# EAGLE schematic Sparkfun_MPU-9150_breakout (EAGLE 6.3)
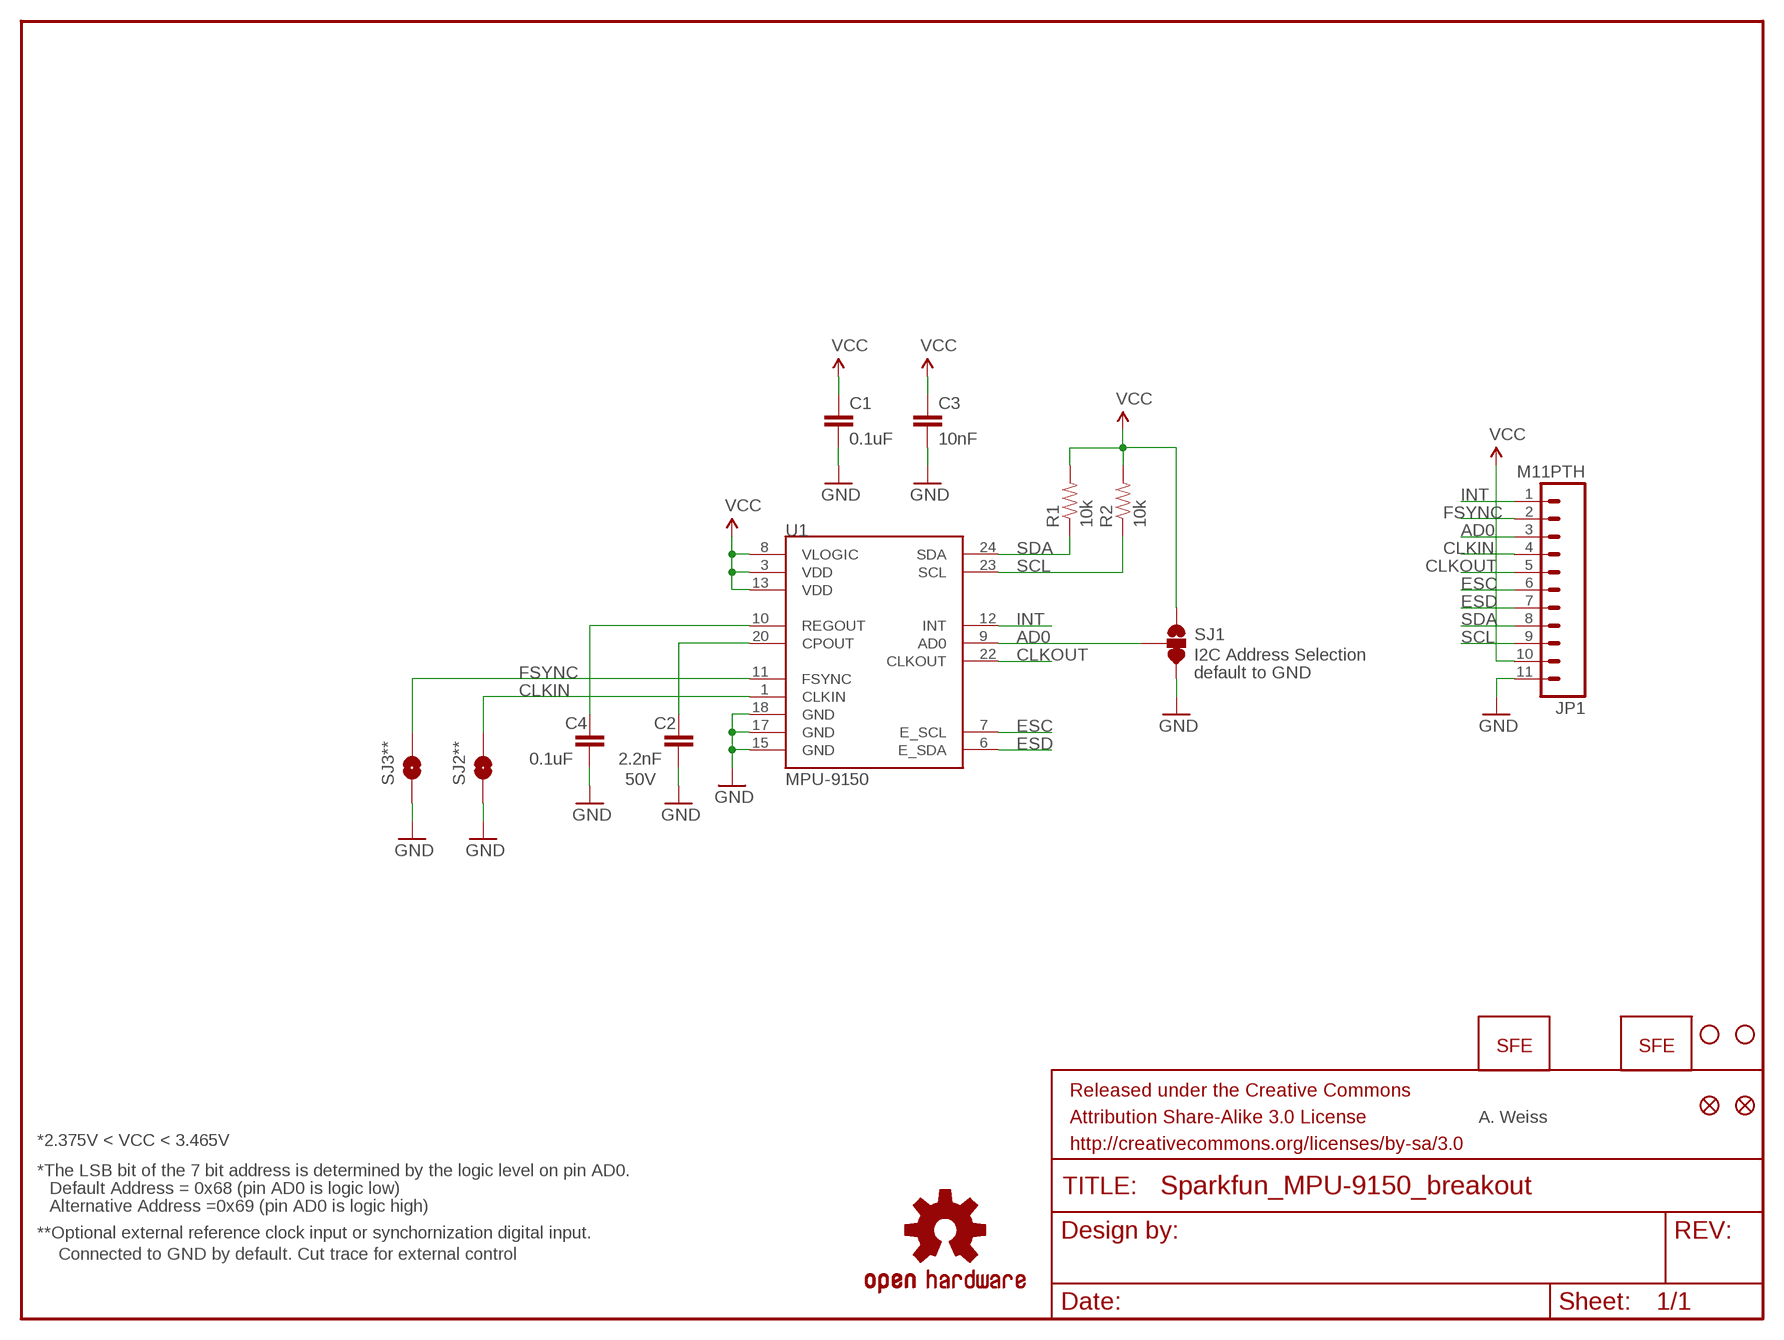
[diagram p0: schematic, sheet 1]

## Parts
C1  0.1uF  CAP0402-CAP  [0402-CAP]
C2  2.2nF  CAP0402-CAP  [0402-CAP]
C3  10nF  CAP0402-CAP  [0402-CAP]
C4  0.1uF  CAP0402-CAP  [0402-CAP]
JP1  M11PTH  [1X11]
JP2  STAND-OFF  [STAND-OFF]
JP3  STAND-OFF  [STAND-OFF]
JP4  LOGO-SFENW2  [SFE-NEW-WEB]
JP6  LOGO-SFESK  [SFE-LOGO-FLAME]
JP7  FIDUCIALUFIDUCIAL  [MICRO-FIDUCIAL]
JP8  FIDUCIALUFIDUCIAL  [MICRO-FIDUCIAL]
R1  10k  RESISTOR0402-RES  [0402-RES]
R2  10k  RESISTOR0402-RES  [0402-RES]
SJ1  SOLDERJUMPER_2WAYPASTE2&3  [SJ_3_PASTE2&3]
SJ2**  SOLDERJUMPERTRACE  [SJ_2S-TRACE]
SJ3**  SOLDERJUMPERTRACE  [SJ_2S-TRACE]
U1  MPU-9150  MPU-9150QFN-24-NP  [QFN-24-NP]
U$1  OSHW-LOGOS  [OSHW-LOGO-S]

## Nets
AD0: JP1.3 SJ1.2 U1.9(AD0)
CLKIN: JP1.4 SJ2**.2 U1.1(CLKIN)
CLKOUT: JP1.5 U1.22(CLKOUT)
ESC: JP1.6 U1.7(E_SCL)
ESD: JP1.7 U1.6(E_SDA)
FSYNC: JP1.2 SJ3**.2 U1.11(FSYNC)
GND: C1.2 C2.2 C3.2 C4.2 JP1.11 SJ1.3 SJ2**.1 SJ3**.1 U1.15(GND) U1.17(GND) U1.18(GND)
INT: JP1.1 U1.12(INT)
N$1: C2.1 U1.20(CPOUT)
N$2: C4.1 U1.10(REGOUT)
SCL: JP1.8 R2.1 U1.23(SCL)
SDA: JP1.9 R1.1 U1.24(SDA)
VCC: C1.1 C3.1 JP1.10 R1.2 R2.2 SJ1.1 U1.3(VDD) U1.8(VLOGIC) U1.13(VDD)

## Notes on the sheet
- I2C Address Selection
- default to GND
- 50V
- A. Weiss
- *2.375V < VCC < 3.465V
- *The LSB bit of the 7 bit address is determined by the logic level on pin AD0.
- Default Address = 0x68 (pin AD0 is logic low)
- Alternative Address =0x69 (pin AD0 is logic high)
- **Optional external reference clock input or synchornization digital input.
- Connected to GND by default. Cut trace for external control

## Library data of the parts
C1-C4 = SparkFun-Passives:CAP: Capacitor Standard 0603 ceramic capacitor, and 0.1" leaded capacitor.
JP1 = SparkFun-Connectors:M11: Header 11 Standard 11-pin 0.1" header. Use with straight break away headers (SKU : PRT-00116), right angle break away headers (PRT-00553), swiss pins (PRT-00743), machine pins (PRT-00117), and female headers (PRT-00115).
JP2 JP3 = SparkFun-Electromechanical:STAND-OFF: #4 Stand Off This is the mechanical footprint for a #4 phillips button head screw. Use the keepout ring to avoid running the screw head into surrounding components. SKU : PRT-00447
JP4 JP6 = SparkFun-Aesthetics:LOGO-SFE: Spark Fun Electronics PCB Logo This is the standard Spark Fun Electronics PCB logo.
JP7 JP8 = SparkFun:FIDUCIAL: Fiducial Alignment Points Various fiducial points for machine vision alignment.
R1 R2 = SparkFun-Passives:RESISTOR: Resistor Basic schematic elements and footprints for 0603, 1206, and PTH resistors.
SJ1 = SparkFun-Passives:SOLDERJUMPER_2WAY: Solder Jumper 2 way solder jumper
SJ2** SJ3** = SparkFun-Passives:SOLDERJUMPER: Solder Jumper Standard SMD solder jumper. Used to automate production. Two varients : Normally Open and Normally Closed are the same, but have different paste layers. NC will have a large amount of paste and should jumper during reflow.
U1 = SparkFun-Sensors:MPU-9150: 9DOF (3mag, 3accel, 3rotat). I2C interface.
U$1 = SparkFun-Aesthetics:OSHW-LOGO: Open Source Hardware Logo This logo indicates the piece of hardware it is found on incorporates a OSHW license and/or adheres to the definition of open source hardware found here: http://freedomdefined.org/OSHW